# EAGLE design Quadcopter PCB (EAGLE 7.7.0)
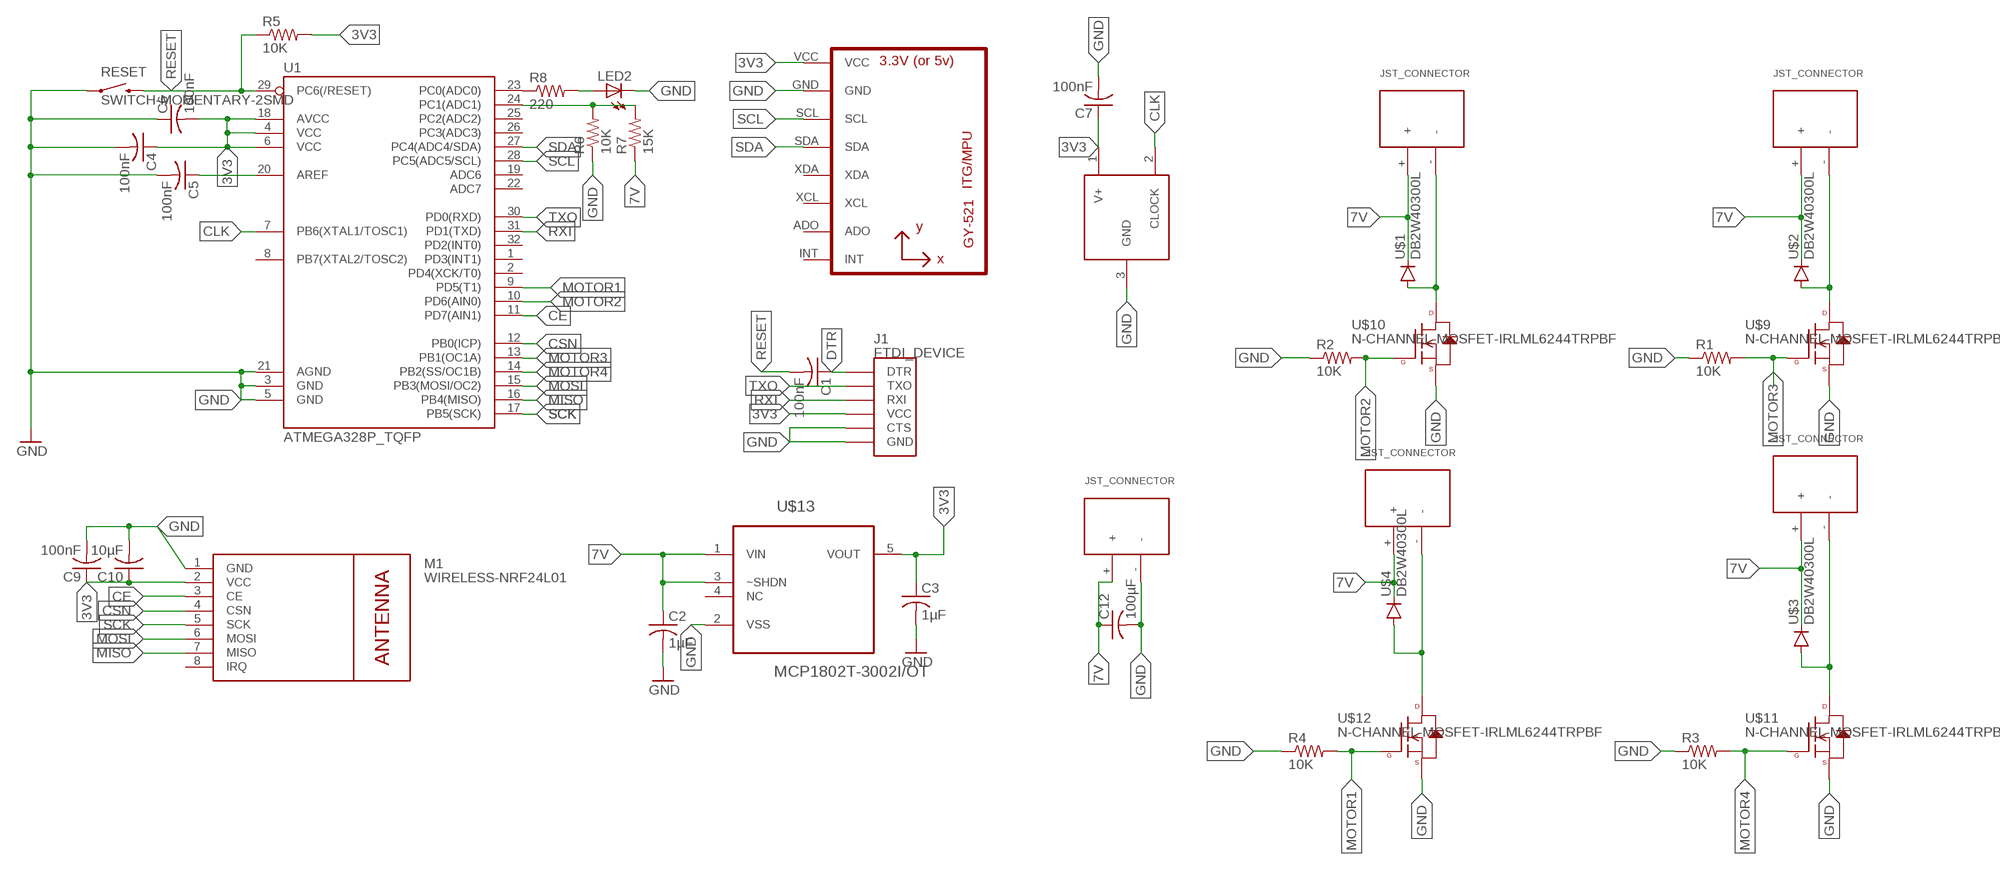
[diagram p0: schematic, sheet 1]

## Parts
AXR1  MAX7375  [SC70-3L]
BATTERYJSTCONNECTOR  JST_CONNECTOR_FEMALE  [JST_CONNECTOR_FEMALE]
C1  100nF  C-USC0603  [C0603]
C2  1µF  C-USC0603  [C0603]
C3  1µF  C-USC0603  [C0603]
C4  100nF  C-USC0603  [C0603]
C5  100nF  C-USC0603  [C0603]
C6  100nF  C-USC0603  [C0603]
C7  100nF  C-USC0603  [C0603]
C9  100nF  C-USC0603  [C0603]
C10  10µF  C-USC0603  [C0603]
C12  100µF  C-USC1210  [C1210]
J1  FTDI_DEVICE  [FTDI_DEVICE_SIDE]
LED2  LEDCHIP-LED0603  [CHIP-LED0603]
M1  WIRELESS-NRF24L01  [WIRELESS-NRF24L01]
R1  10K  R-US_R0603  [R0603]
R2  10K  R-US_R0603  [R0603]
R3  10K  R-US_R0603  [R0603]
R4  10K  R-US_R0603  [R0603]
R5  10K  R-US_R0603  [R0603]
R6  10K  R-US_R0603  [R0603]
R7  15K  R-US_R0603  [R0603]
R8  220  R-US_R0603  [R0603]
RESET  SWITCH-MOMENTARY-2SMD  [TACTILE-SWITCH-SMD]
U1  ATMEGA328P_TQFP  [TQFP32-08]
U2  GY-521MPU6050  [GY-521]
U$1  DB2W40300L  [MINI2-F3-B]
U$2  DB2W40300L  [MINI2-F3-B]
U$3  DB2W40300L  [MINI2-F3-B]
U$4  DB2W40300L  [MINI2-F3-B]
U$5  JST_CONNECTOR_FEMALE  [JST_CONNECTOR_FEMALE]
U$6  JST_CONNECTOR_FEMALE  [JST_CONNECTOR_FEMALE]
U$7  JST_CONNECTOR_FEMALE  [JST_CONNECTOR_FEMALE]
U$8  JST_CONNECTOR_FEMALE  [JST_CONNECTOR_FEMALE]
U$9  N-CHANNEL-MOSFET-IRLML6244TRPBF  [SOT23-3]
U$10  N-CHANNEL-MOSFET-IRLML6244TRPBF  [SOT23-3]
U$11  N-CHANNEL-MOSFET-IRLML6244TRPBF  [SOT23-3]
U$12  N-CHANNEL-MOSFET-IRLML6244TRPBF  [SOT23-3]
U$13  MCP1802T-3002I/OT  [SOT95P270X145-5N]

## Nets
3V3: AXR1.1(V+) C3.1 C4.1 C5.1 C6.2 C7.1 C9.1 C10.1 J1.P$4(VCC) M1.2(VCC) R5.2 U1.4(VCC) U1.6(VCC) U1.18(AVCC) U1.20(AREF) U2.VCC U$13.5(VOUT)
7V: BATTERYJSTCONNECTOR.+ C2.1 C12.1 R7.1 U$1.NEG(GPIN) U$2.NEG(GPIN) U$3.NEG(GPIN) U$4.NEG(GPIN) U$5.+ U$6.+ U$7.+ U$8.+ U$13.1(VIN) U$13.3(~SHDN)
CE: M1.3(CE) U1.11(PD7(AIN1))
CLK: AXR1.2(CLOCK) U1.7(PB6(XTAL1/TOSC1))
CSN: M1.4(CSN) U1.12(PB0(ICP))
DTR: C1.1 J1.P$1(DTR)
GND: AXR1.3(GND) BATTERYJSTCONNECTOR.- C2.2 C3.2 C4.2 C5.2 C6.1 C7.2 C9.2 C10.2 C12.2 J1.P$5(CTS) J1.P$6(GND) LED2.C M1.1(GND) R1.1 R2.1 R3.1 R4.1 R6.1 RESET.1 U1.3(GND) U1.5(GND) U1.21(AGND) U2.GND U$9.2(S) U$10.2(S) U$11.2(S) U$12.2(S) U$13.2(VSS)
MISO: M1.7(MISO) U1.16(PB4(MISO))
MOSI: M1.6(MOSI) U1.15(PB3(MOSI/OC2))
MOTOR1: R4.2 U1.9(PD5(T1)) U$12.1(G)
MOTOR2: R2.2 U1.10(PD6(AIN0)) U$10.1(G)
MOTOR3: R1.2 U1.13(PB1(OC1A)) U$9.1(G)
MOTOR4: R3.2 U1.14(PB2(SS/OC1B)) U$11.1(G)
N$9: R6.2 R7.2 U1.24(PC1(ADC1))
N$10: R8.1 U1.23(PC0(ADC0))
N$12: LED2.A R8.2
N$15: U$1.POS(PPIN) U$6.- U$10.3(D)
N$20: U$2.POS(PPIN) U$7.- U$9.3(D)
N$25: U$3.POS(PPIN) U$8.- U$11.3(D)
N$26: U$4.POS(PPIN) U$5.- U$12.3(D)
RESET: C1.2 R5.1 RESET.3 U1.29(PC6(/RESET))
RXI: J1.P$3(RXI) U1.31(PD1(TXD))
SCK: M1.5(SCK) U1.17(PB5(SCK))
SCL: U1.28(PC5(ADC5/SCL)) U2.SCL
SDA: U1.27(PC4(ADC4/SDA)) U2.SDA
TXO: J1.P$2(TXO) U1.30(PD0(RXD))
Unconnected: M1.8(IRQ) U1.1(PD3(INT1)) U1.2(PD4(XCK/T0)) U1.8(PB7(XTAL2/TOSC2)) U1.19(ADC6) U1.22(ADC7) U1.25(PC2(ADC2)) U1.26(PC3(ADC3)) U1.32(PD2(INT0)) U2.ADO U2.INT U2.XCL U2.XDA U$13.4(NC)

## Library data of the parts
AXR1 = quad library :MAX7375
BATTERYJSTCONNECTOR U$5-U$8 = quad library :JST_CONNECTOR_FEMALE
C1-C3 C6 C7 C9 C10 = rcl:C-US: CAPACITOR, American symbol
C4 C5 C12 = resistor:C-US: CAPACITOR, American symbol
J1 = quad library :FTDI_DEVICE: Connector which mates to FTDI basic or FTDI cable.
LED2 = led:LED: LED OSRAM: - CHIPLED LG R971, LG N971, LY N971, LG Q971, LY Q971, LO R971, LY R971 LH N974, LH R974 LS Q976, LO Q976, LY Q976 LO Q996 - Hyper CHIPLED LW Q18S LB Q993, LB Q99A, LB R99A - SideLED LS A670, LO A670, LY A670, LG A670, LP A670 LB A673, LV A673, LT A673, LW A673 LH A674 LY A675 LS A676, LA A676, LO A676, LY A676, LW A676 LS A679, LY A679, LG A679 - Hyper Micro SIDELED® LS Y876, LA Y876, LO Y876, LY Y876 LT Y87S - SmartLED LW L88C, LW L88S LB L89C, LB L89S, LG L890 LS L89K, LO L89K, LY L89K LS L896, LA L896, LO L896, LY L896 - TOPLED LS T670, LO T670, LY T670, LG T670, LP T670 LSG T670, LSP T670, LSY T670, LOP T670, LYG T670 LG T671, LOG T671, LSG T671 LB T673, LV T673, LT T673, LW T673 LH T674 LS T676, LA T676, LO T676, LY T676, LB T676, LH T676, LSB T676, LW T676 LB T67C, LV T67C, LT T67C, LS T67K, LO T67K, LY T67K, LW E67C LS E67B, LA E67B, LO E67B, LY E67B, LB E67C, LV E67C, LT E67C LW T67C LS T679, LY T679, LG T679 LS T770, LO T770, LY T770, LG T770, LP T770 LB T773, LV T773, LT T773, LW T773 LH T774 LS E675, LA E675, LY E675, LS T675 LS T776, LA T776, LO T776, LY T776, LB T776 LHGB T686 LT T68C, LB T68C - Hyper Mini TOPLED® LB M676 - Mini TOPLED Santana® LG M470 LS M47K, LO M47K, LY M47K Source: http://www.osram.convergy.de LUXEON: - LUMILED® LXK2-PW12-R00, LXK2-PW12-S00, LXK2-PW14-U00, LXK2-PW14-V00 LXK2-PM12-R00, LXK2-PM12-S00, LXK2-PM14-U00 LXK2-PE12-Q00, LXK2-PE12-R00, LXK2-PE12-S00, LXK2-PE14-T00, LXK2-PE14-U00 LXK2-PB12-K00, LXK2-PB12-L00, LXK2-PB12-M00, LXK2-PB14-N00, LXK2-PB14-P00, LXK2-PB14-Q00 LXK2-PR12-L00, LXK2-PR12-M00, LXK2-PR14-Q00, LXK2-PR14-R00 LXK2-PD12-Q00, LXK2-PD12-R00, LXK2-PD12-S00 LXK2-PH12-R00, LXK2-PH12-S00 LXK2-PL12-P00, LXK2-PL12-Q00, LXK2-PL12-R00 Source: www.luxeon.com KINGBRIGHT: KA-3528ASYC Source: www.kingbright.com
M1 = quad library :WIRELESS-NRF24L01: 2.4 GHz Wireless Module based on NRF24L01 chip
R1-R5 R8 = rcl:R-US_: RESISTOR, American symbol
R6 R7 = resistor:R-US_: RESISTOR, American symbol
RESET = quad library :SWITCH-MOMENTARY-2: Various NO switches- pushbuttons, reed, etc; PROD_ID: SWCH-08247
U1 = quad library :ATMEGA328P_TQFP; PROD_ID: IC-09069
U2 = quad library :GY-521
U$1-U$4 = quad library :DB2W40300L
U$9-U$12 = quad library :N-CHANNEL-MOSFET: N-Channel MOSFET Mode Field Effect Transistor; DATASHEET: http://www.mouser.com/ds/2/196/irlml6244pbf-936666.pdf; MOUSER: 942-IRLML6244TRPBF; URL: http://www.mouser.com/Search/ProductDetail.aspx?R=IRLML6244TRPBFvirtualkey57370000virtualkey942-IRLML6244TRPBF
U$13 = quad library :MCP1802T-3002I/OT: Low Quiescent Current LDO; MPN: MCP1802T-3002I/OT; OC_FARNELL: 1578373; OC_NEWARK: 54M4837; PACKAGE: SOT-5; SUPPLIER: Microchip

## Board
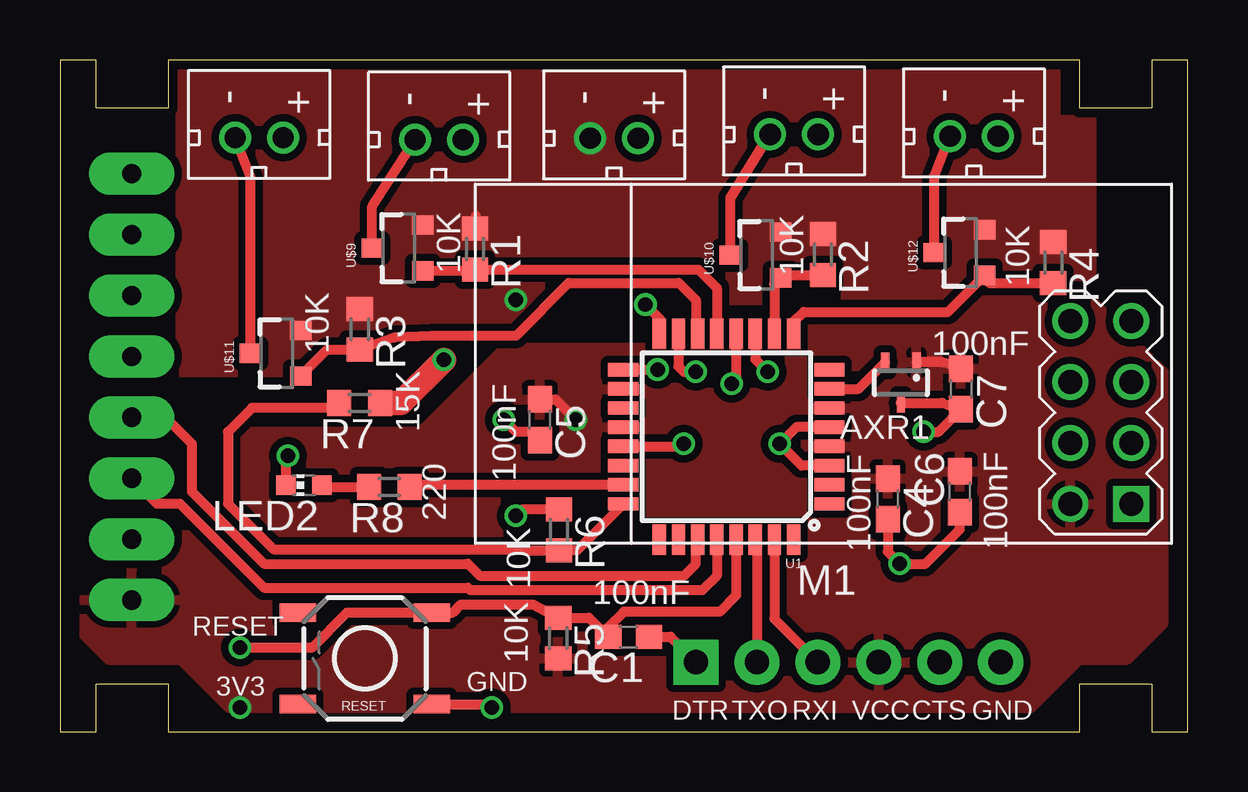
[diagram p1: board, top side]
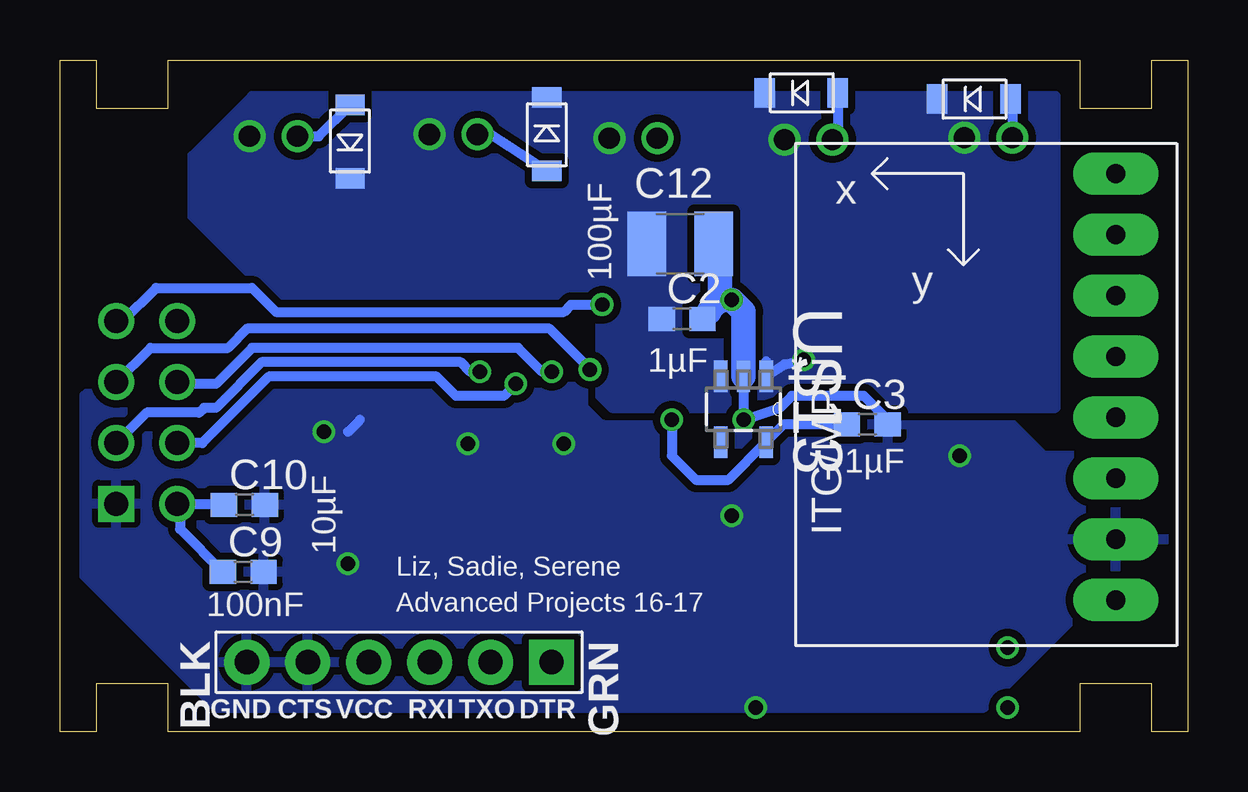
[diagram p2: board, bottom side, seen from below]

Size 47 x 28 mm. Coordinates in mm from the lower left corner, seen from the top.
Outline: 0,0 1.5,0 1.5,2 4.5,2 4.5,0 42.5,0 42.5,2 45.5,2 45.5,0 47,0 47,28 45.5,28 45.5,26 42.5,26 42.5,28 4.5,28 4.5,26 1.5,26 1.5,28 0,28 0,0
Copper layers (1*16): Top 0.0356mm / dielectric 1.5011mm / Bottom 0.0356mm
Design rules "LaenPCBOrder": minimum track width 6mil, minimum drill 13mil, track to track 6mil, track to pad 6mil, pad to pad 6mil, via to via 6mil, smd to smd 6mil, copper to edge 15mil, drill to drill 6mil, minimum pad ring 7mil, minimum via ring 7mil, stop-mask expansion 3mil, vias tented up to drill 0mil, thermal gap 10mil

### Footprints (pad centres in the part's own frame; a part is rotated, then mirrored left to right if it is on the bottom)
SC70-3L = smd 0.35 x 0.8: 1 -0.65,-0.85; 2 0.65,-0.85; 3 0,0.85
JST_CONNECTOR_FEMALE = drill 0.889: + 0,1; - 0,-1
C0603 = smd 1.1 x 1: 1 -0.85,0; 2 0.85,0
C1210 = smd 1.6 x 2.7: 1 -1.4,0; 2 1.4,0
FTDI_DEVICE_SIDE = drill 1.016 pad 1.88 square: P$1 -6.35,0 | drill 1.016 pad 1.88: P$2 -3.81,0; P$3 -1.27,0; P$4 1.27,0; P$5 3.81,0; P$6 6.35,0
CHIP-LED0603 = smd 0.8 x 0.8: A 0,-0.75; C 0,0.75
WIRELESS-NRF24L01 = drill 1 square: 1 -12.7,6.35 | drill 1: 2 -10.16,6.35; 3 -12.7,3.81; 4 -10.16,3.81; 5 -12.7,1.27; 6 -10.16,1.27; 7 -12.7,-1.27; 8 -10.16,-1.27
R0603 = smd 1 x 1.1: 1 -0.85,0; 2 0.85,0
TACTILE-SWITCH-SMD = smd 1.524 x 0.762: 1 -2.794,1.905; 2 2.794,1.905; 3 -2.794,-1.905; 4 2.794,-1.905
TQFP32-08 = smd 1.27 x 0.559: 1 -4.293,2.8; 2 -4.293,2; 3 -4.293,1.2; 4 -4.293,0.4; 5 -4.293,-0.4; 6 -4.293,-1.2; 7 -4.293,-2; 8 -4.293,-2.8; 17 4.293,-2.8; 18 4.293,-2; 19 4.293,-1.2; 20 4.293,-0.4; 21 4.293,0.4; 22 4.293,1.2; 23 4.293,2; 24 4.293,2.8 | smd 0.559 x 1.27: 9 -2.8,-4.293; 10 -2,-4.293; 11 -1.2,-4.293; 12 -0.4,-4.293; 13 0.4,-4.293; 14 1.2,-4.293; 15 2,-4.293; 16 2.8,-4.293; 25 2.8,4.293; 26 2,4.293; 27 1.2,4.293; 28 0.4,4.293; 29 -0.4,4.293; 30 -1.2,4.293; 31 -2,4.293; 32 -2.8,4.293
GY-521 = drill 0.8 pad 1.778 long: ADO -8.89,-6.35; GND -8.89,6.35; INT -8.89,-8.89; SCL -8.89,3.81; SDA -8.89,1.27; VCC -8.89,8.89; XCL -8.89,-3.81; XDA -8.89,-1.27
MINI2-F3-B = smd 1.22 x 0.85: NEG 0,1.55; POS 0,-1.5
SOT23-3 = smd 0.8 x 0.9: 1 -0.95,-1; 2 0.95,-1; 3 0,1.1
SOT95P270X145-5N = smd 1.321 x 0.559: 1 -1.372,0.94; 2 -1.372,0; 3 -1.372,-0.94; 4 1.372,-0.94; 5 1.372,0.94

### Placement (x,y rotation side)
AXR1  35.05,14.55 180 top
BATTERYJSTCONNECTOR  23.1,24.74 270 top
C1  23.7,3.95 180 top
C2  21.07,17.2 0 bottom
C3  13.35,12.8 0 bottom
C4  34.5,9.7 270 top
C5  20,13 270 top
C6  37.5,10 90 top
C7  37.55,14.28 270 top
C9  39.36,6.65 0 bottom
C10  39.31,9.45 0 bottom
C12  21.15,20.33 0 bottom
J1  32.86,2.89 180 bottom
LED2  10.17,10.27 90 top
M1  31.95,15.84 180 top
R1  17.3,20.11 270 top
R2  31.8,19.89 270 top
R3  12.5,16.77 270 top
R4  41.4,19.55 270 top
R5  20.77,3.9 270 top
R6  20.8,8.41 270 top
R7  12.49,13.7 180 top
R8  13.73,10.2 180 top
RESET  12.71,3.05 180 top
U1  27.78,12.29 180 top
U2  11.88,14.37 180 bottom
U$1  26.71,24.88 0 bottom
U$2  16.08,26.63 90 bottom
U$3  8.88,26.37 90 bottom
U$4  34.91,24.62 180 bottom
U$5  38.1,24.82 270 top
U$6  30.6,24.9 270 top
U$7  15.8,24.68 270 top
U$8  8.3,24.76 270 top
U$9  14.12,20.16 90 top
U$10  29.04,19.87 90 top
U$11  9.04,15.77 90 top
U$12  37.54,19.97 90 top
U$13  18.51,13.44 270 bottom

### Tracks (layer width: path | path; a pad name or v marks a point on that pad's centre or on a via)
3V3  (via drill 0.6)
  Top 0.406: C7.1 36.78,15.4 AXR1.1 | C5.1 20.65,13.85 v21.5,13
  Bottom 0.406: C10.1 40.16,9.49 M1.2 42,9.38 42,8.44 C9.1 | v21.5,13 21.5,11.5 20.5,10.5 19.14,10.5 U$13.5 16.84,12.8 C3.1
  other vias: 7.5,1
  pour Top (isolate 0.305, rank 2): 1,11.5 1,4 2,3 5,3 7,1 40.5,1 42.5,3 44.5,3 46,4.5 46,15 43,18 31.5,18 29.5,16 18.5,16 15,12.5 2,12.5
7V  (via drill 0.6)
  Top 1.016: v16,15.5 14.2,13.7 R7.1
  Bottom 0.406: 17.57,15.43 U$13.1 16.81,15.31 v16,15.5
  pour Bottom (isolate 0.305, no thermals): 5.5,26.5 39,26.5 41.5,24 41.5,21.5 37.5,17.5 25,17.5 24.5,17 24.5,14 24,13.5 5.5,13.5
CE  (via drill 0.6)
  Top 0.406: U1.11 28.98,15.52 v29.5,15
  Bottom 0.406: v29.5,15 29.9,15 30.3,15.4 38.6,15.4 40.5,13.5 41,13.5 41.2,13.3 43.38,13.3 M1.3
CLK
  Top 0.406: U1.7 33.29,14.29 AXR1.2
CSN  (via drill 0.6)
  Top 0.406: U1.12 28.18,14.68 v28,14.5
  Bottom 0.406: v28,14.5 28.5,14 30.5,14 31.3,14.8 38.3,14.8 41.07,12.03 M1.4
DTR
  Top 0.406: C1.1 25.45,3.95 J1.P$1
GND  (via drill 0.6)
  Top 0.406: R1.1 17.34,21.5 | C5.2 20,12.5 19,12.5 v18.5,13 | 23.89,11.89 U1.21 25.89,11.89 v26,12 | U1.5 30.69,12.69 v30,12 30.91,11.09 U1.3 | C4.2 34.5,7.5 v35,7 36.08,7 37.5,8.42 C6.1 | LED2.C 9.42,11.42 v9.5,11.5 | AXR1.3 36.78,13.7 C7.2 36.62,12.5 v36,12.5 | 20.74,9.26 R6.1 19.26,9.26 v19,9 | RESET.1 17.86,1.15 v18,1
  Bottom 0.406: C2.2 19.92,17.5 | U$13.2 18.5,15.8 v18.5,13 17,13.5 16.5,14 13.5,14 12.5,13 C3.2 | 35,12.5 34.5,13
  Bottom 0.813: U$13.2 18.5,15.82
  Bottom 1.016: U$13.2 18.51,17.51 v19,18 19.5,18 | 19.92,17.5 19.92,17.58 19.5,18 | 19.5,18 19.5,20.08 C12.2
  pour Bottom (isolate 0.305, rank 2): 6,11.5 7.5,13 21,13 25,17 43,17 46,14 46,6.5 40.5,1 8.5,1 4.5,5 2,5 1,6 1,10.5 2,11.5
  pour Top (isolate 0.305, no thermals): 5,27.5 5,15 14,15 14,16.5 22.5,16.5 22.5,18 40.5,18 40.5,19 43,19 43,25.5 41.5,25.5 41.5,27.5
MISO  (via drill 0.6)
  Top 0.406: U1.16 24.98,16.98 25,17 25,17.2 v24.4,17.8
  Bottom 0.406: M1.7 44.39,17.11 43,18.5 39,18.5 38,17.5 26,17.5 25.7,17.8 v24.4,17.8
MOSI  (via drill 0.6)
  Top 0.406: U1.15 25.78,15.22 26,15 v26.5,15
  Bottom 0.406: v26.5,15 26.9,15 27.9,16 39,16 40.5,14.5 42.04,14.5 M1.6
MOTOR1
  Top 0.406: U$12.1 38.72,18.7 R4.2 | U$12.1 38.52,19 | U1.9 30.58,17.08 31,17.5 37.02,17.5 U$12.1
MOTOR2
  Top 0.406: R2.2 30.16,19.04 U$10.1 29.78,18.66 U1.10
MOTOR3
  Top 0.406: U1.13 27.38,18.5 26.62,19.26 R1.2 17.3,19.21 U$9.1
MOTOR4
  Top 0.406: U$11.1 11.14,15.92 R3.2 13.92,16.42 15.5,16.5 19,16.5 21.2,18.7 25.8,18.7 26.5,18 26.5,16.66 U1.14
N$9
  Top 0.406: R7.2 11.44,13.5 8,13.5 7,12.5 7,9.5 8.9,7.6 19.46,7.6 19.5,7.56 R6.2 21.56,7.56 U1.24
N$10
  Top 0.406: U1.23 15.17,10.29 R8.1
N$12
  Top 0.406: 12.99,10.2 R8.2 10.99,10.2 LED2.A
N$15
  Top 0.406: U$10.3 27.94,22.24 U$6.-
  Bottom 0.406: U$1.POS 29.38,25.12 U$6.-
N$20
  Top 0.406: U$9.3 13.02,21.9 U$7.-
  Bottom 0.406: U$2.POS 14.58,24.9 U$7.-
N$25
  Top 0.406: U$11.3 7.94,23.12 U$8.-
  Bottom 0.406: 7.3,26.3 7.5,26.5 | 7.3,26.3 U$8.- | 7.3,26.3 7.31,26.3 U$3.POS
N$26
  Top 0.406: U$12.3 36.44,23.16 U$5.-
  Bottom 0.406: U$5.- 36.21,24.82 U$4.POS
RESET  (via drill 0.6)
  Top 0.406: v7.5,3.5 10.5,3.5 11.96,4.96 RESET.3 16.36,4.96 16.7,5.3 19.72,5.3 R5.1 22.05,4.75 C1.2 22.85,4.35 23.5,5 27.5,5 28.18,5.68 U1.29
RXI
  Top 0.406: U1.31 29.78,4.7 J1.P$3
SCK  (via drill 0.6)
  Top 0.406: U1.17 v24.91,15.09
  Bottom 0.406: M1.5 43.22,16 40,16 39.2,16.8 26.6,16.8 24.91,15.11 v24.91,15.09
SCL
  Top 0.406: U1.28 27.38,6.5 26.78,5.9 17.1,5.9 17,6 8.5,6 5,9.5 4.05,9.5 U2.SCL
SDA
  Top 0.406: 26.58,8.08 U1.27 26.5,8.42 26.5,7 26,6.5 17.5,6.5 17,7 8.5,7 5.5,10 5.5,12 4.5,13 3.09,13 U2.SDA
TXO
  Top 0.406: U1.30 29.05,8.43 J1.P$2

### Text on the board
tPlace: 10K | 10K | 10K | 10K | 100nF | 100nF | 15K | 220 | 10K | 100nF | 100nF | 10K | 100nF | RESET | 3V3 | GND | DTR | TXO | RXI | VCC | CTS | GND
bPlace: 100µF | 1µF | 1µF | 10µF | Liz, Sadie, Serene | Advanced Projects 16-17 | 100nF